# EAGLE schematic platine-br110 (EAGLE 9.6.2)
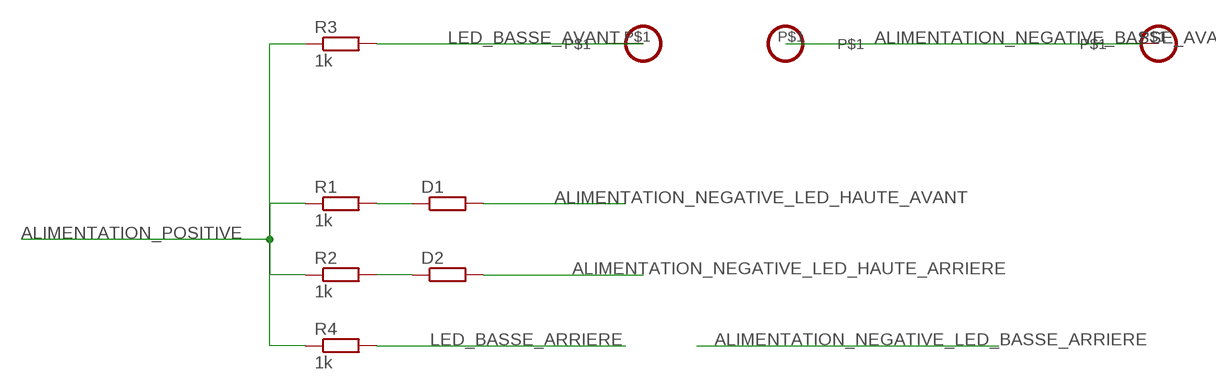
[diagram p0: schematic, sheet 1]

## Parts
D1  R-EU_M0805  [M0805]
D2  R-EU_M0805  [M0805]
PASTILLE1  PASTILLE-1-PIN  [PASTILLE-1-PIN]
PASTILLE2  PASTILLE-1-PIN  [PASTILLE-1-PIN]
PASTILLE3  PASTILLE-1-PIN  [PASTILLE-1-PIN]
R1  1k  R-EU_M1206  [M1206]
R2  1k  R-EU_M1206  [M1206]
R3  1k  R-EU_M1206  [M1206]
R4  1k  R-EU_M1206  [M1206]

## Nets
ALIMENTATION_NEGATIVE_BASSE_AVANT: PASTILLE2.P$1
ALIMENTATION_NEGATIVE_LED_HAUTE_ARRIERE: D2.2
ALIMENTATION_NEGATIVE_LED_HAUTE_AVANT: D1.2
ALIMENTATION_POSITIVE: R1.1 R2.1 R3.1 R4.1
LED_BASSE_ARRIERE: R4.2
LED_BASSE_AVANT: PASTILLE1.P$1 R3.2
N$1: D1.1 R1.2
N$2: D2.1 R2.2
Unconnected: PASTILLE3.P$1

## Library data of the parts
D1 D2 R1-R4 = rcl:R-EU_: RESISTOR, European symbol; SPICEPREFIX: R
PASTILLE1-PASTILLE3 = pcb-alain-train:PASTILLE-1-PIN: PASTILLE 1 PIN

## Module TEST
Ports: 

### Library data of the parts